# EAGLE design interceptor (EAGLE 8.5.1)
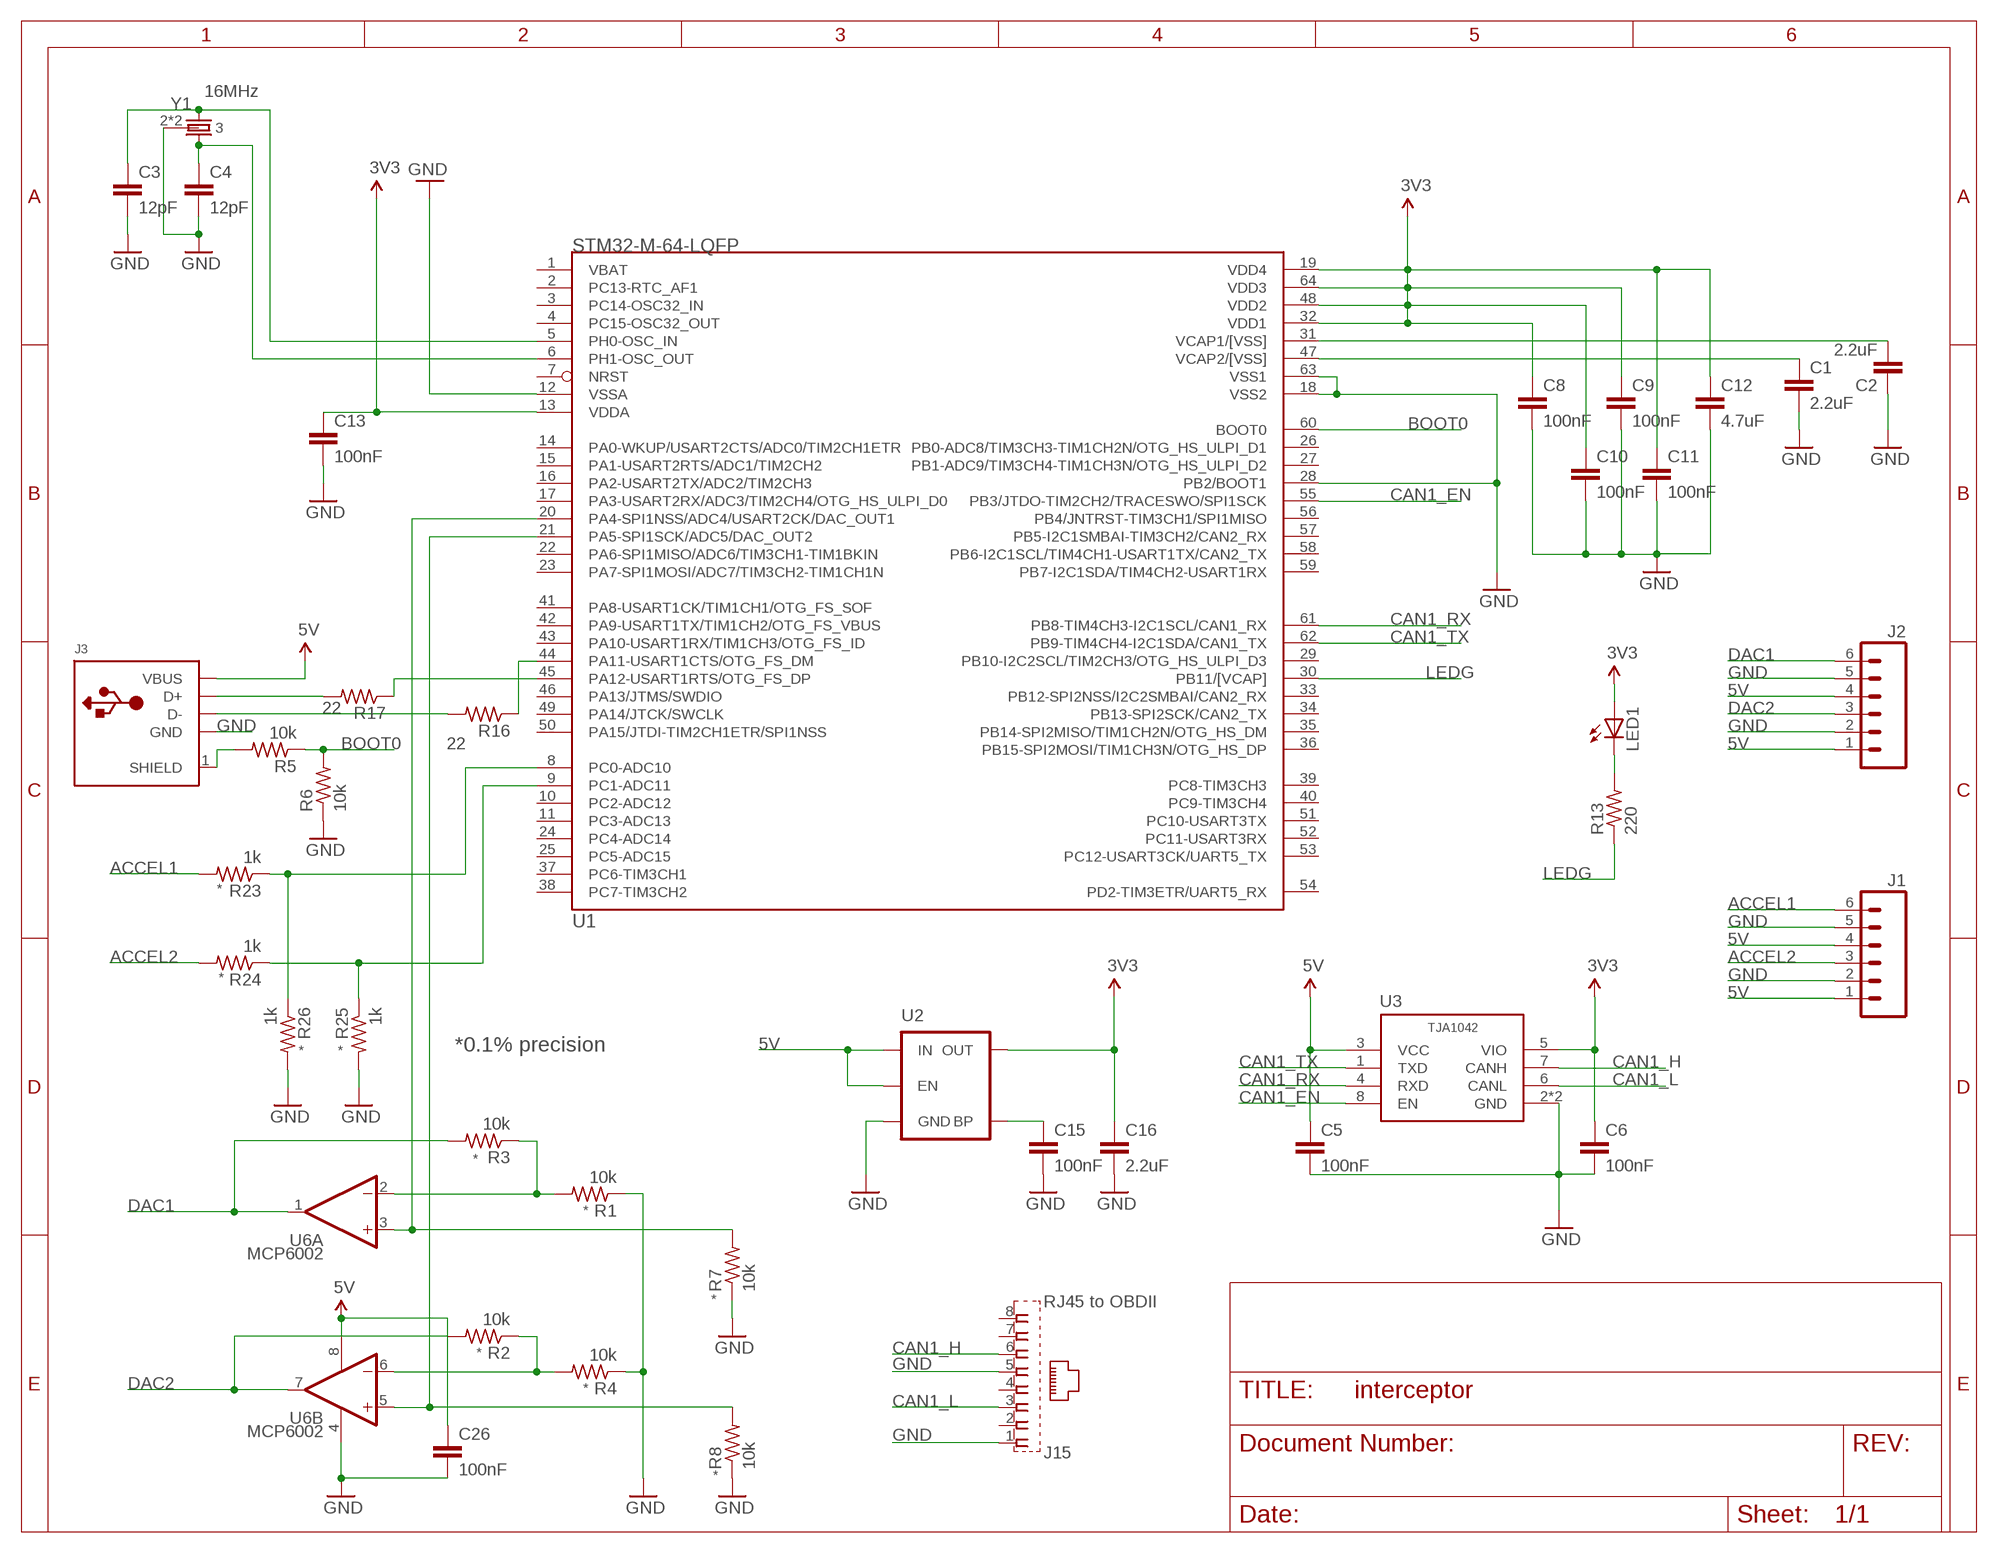
[diagram p0: schematic, sheet 1]

## Parts
C1  2.2uF  C0603  [0603-C]
C2  2.2uF  C0603  [0603-C]
C3  12pF  C0603  [0603-C]
C4  12pF  C0603  [0603-C]
C5  100nF  C0603  [0603-C]
C6  100nF  C0603  [0603-C]
C8  100nF  C0603  [0603-C]
C9  100nF  C0603  [0603-C]
C10  100nF  C0603  [0603-C]
C11  100nF  C0603  [0603-C]
C12  4.7uF  C0603  [0603-C]
C13  100nF  C0603  [0603-C]
C15  100nF  C0603  [0603-C]
C16  2.2uF  C0603  [0603-C]
C26  100nF  C0603  [0603-C]
J1  M06NO_SILK_YES_STOP  [1X06_NO_SILK_YES_STOP]
J2  M06NO_SILK_YES_STOP  [1X06_NO_SILK_YES_STOP]
J3  USB-ASMD-F  [USB-A-S]
J15  RJ45 to OBDII  RA-RJ45RA  [RA-RJ45]
LED1  LEDCHIPLED_0805  [CHIPLED_0805]
R1  10k  R0402  [0402-R]
R2  10k  R0402  [0402-R]
R3  10k  R0402  [0402-R]
R4  10k  R0402  [0402-R]
R5  10k  R0402  [0402-R]
R6  10k  R0402  [0402-R]
R7  10k  R0402  [0402-R]
R8  10k  R0402  [0402-R]
R13  220  R0402  [0402-R]
R16  22  R0402  [0402-R]
R17  22  R0402  [0402-R]
R23  1k  R0402  [0402-R]
R24  1k  R0402  [0402-R]
R25  1k  R0402  [0402-R]
R26  1k  R0402  [0402-R]
U1  STM32-M-64-LQFP  [LQFP64]
U2  MIC52053.3V  [SOT23-5]
U3  TJA1042HVSON  [HVSON8]
U6  MCP6002  LM358D  [SO08]
Y1  16MHz  CRYSTAL-3.2X2.54-PIN  [XTAL-3.2X2.5]

## Nets
3V3: C6.1 C8.1 C9.1 C10.1 C11.1 C12.1 C13.1 C16.1 LED1.A U1.13(VDDA) U1.19(VDD4) U1.32(VDD1) U1.48(VDD2) U1.64(VDD3) U2.5(OUT) U3.5(VIO)
5V: C5.1 C26.1 J1.1 J1.4 J2.1 J2.4 J3.VBUS U2.1(IN) U2.3(EN) U3.3(VCC) U6.8(P:V+)
ACCEL1: J1.6 R23.2
ACCEL2: J1.3 R24.2
BOOT0: R5.1 R6.2 U1.60(BOOT0)
CAN1_EN: U1.55(PB3/JTDO-TIM2CH2/TRACESWO/SPI1SCK) U3.8(EN)
CAN1_H: J15.6 U3.7(CANH)
CAN1_L: J15.3 U3.6(CANL)
CAN1_RX: U1.61(PB8-TIM4CH3-I2C1SCL/CAN1_RX) U3.4(RXD)
CAN1_TX: U1.62(PB9-TIM4CH4-I2C1SDA/CAN1_TX) U3.1(TXD)
DAC1: J2.6 R3.2 U6.1(A:OUT)
DAC2: J2.3 R2.2 U6.7(B:OUT)
GND: C1.2 C2.1 C3.2 C4.2 C5.2 C6.2 C8.2 C9.2 C10.2 C11.2 C12.2 C13.2 C15.2 C16.2 C26.2 J1.2 J1.5 J2.2 J2.5 J3.GND J15.1 J15.5 R1.1 R4.1 R6.1 R7.1 R8.1 R25.2 R26.2 U1.12(VSSA) U1.18(VSS2) U1.28(PB2/BOOT1) U1.63(VSS1) U2.2(GND) U3.2(GND) U3.PAD(GND) U6.4(P:V-) Y1.2 Y1.4
LEDG: R13.1 U1.30(PB11/[VCAP])
N$1: C3.1 U1.5(PH0-OSC_IN) Y1.1
N$2: R16.1 U1.44(PA11-USART1CTS/OTG_FS_DM)
N$3: C4.1 U1.6(PH1-OSC_OUT) Y1.3
N$4: R17.1 U1.45(PA12-USART1RTS/OTG_FS_DP)
N$5: J3.D- R16.2
N$6: J3.D+ R17.2
N$7: J3.1(SHIELD) R5.2
N$17: R7.2 U1.20(PA4-SPI1NSS/ADC4/USART2CK/DAC_OUT1) U6.3(A:+IN)
N$18: R8.2 U1.21(PA5-SPI1SCK/ADC5/DAC_OUT2) U6.5(B:+IN)
N$21: R1.2 R3.1 U6.2(A:-IN)
N$22: R2.1 R4.2 U6.6(B:-IN)
N$26: LED1.C R13.2
N$29: C15.1 U2.4(BP)
N$41: R23.1 R26.1 U1.8(PC0-ADC10)
N$42: R24.1 R25.1 U1.9(PC1-ADC11)
VCAP1: C2.2 U1.31(VCAP1/[VSS])
VCAP2: C1.1 U1.47(VCAP2/[VSS])
Unconnected: J15.2 J15.4 J15.7 J15.8 U1.1(VBAT) U1.2(PC13-RTC_AF1) U1.3(PC14-OSC32_IN) U1.4(PC15-OSC32_OUT) U1.7(NRST) U1.10(PC2-ADC12) U1.11(PC3-ADC13) U1.14(PA0-WKUP/USART2CTS/ADC0/TIM2CH1ETR) U1.15(PA1-USART2RTS/ADC1/TIM2CH2) U1.16(PA2-USART2TX/ADC2/TIM2CH3) U1.17(PA3-USART2RX/ADC3/TIM2CH4/OTG_HS_ULPI_D0) U1.22(PA6-SPI1MISO/ADC6/TIM3CH1-TIM1BKIN) U1.23(PA7-SPI1MOSI/ADC7/TIM3CH2-TIM1CH1N) U1.24(PC4-ADC14) U1.25(PC5-ADC15) U1.26(PB0-ADC8/TIM3CH3-TIM1CH2N/OTG_HS_ULPI_D1) U1.27(PB1-ADC9/TIM3CH4-TIM1CH3N/OTG_HS_ULPI_D2) U1.29(PB10-I2C2SCL/TIM2CH3/OTG_HS_ULPI_D3) U1.33(PB12-SPI2NSS/I2C2SMBAI/CAN2_RX) U1.34(PB13-SPI2SCK/CAN2_TX) U1.35(PB14-SPI2MISO/TIM1CH2N/OTG_HS_DM) U1.36(PB15-SPI2MOSI/TIM1CH3N/OTG_HS_DP) U1.37(PC6-TIM3CH1) U1.38(PC7-TIM3CH2) U1.39(PC8-TIM3CH3) U1.40(PC9-TIM3CH4) U1.41(PA8-USART1CK/TIM1CH1/OTG_FS_SOF) U1.42(PA9-USART1TX/TIM1CH2/OTG_FS_VBUS) U1.43(PA10-USART1RX/TIM1CH3/OTG_FS_ID) U1.46(PA13/JTMS/SWDIO) U1.49(PA14/JTCK/SWCLK) U1.50(PA15/JTDI-TIM2CH1ETR/SPI1NSS) U1.51(PC10-USART3TX) U1.52(PC11-USART3RX) U1.53(PC12-USART3CK/UART5_TX) U1.54(PD2-TIM3ETR/UART5_RX) U1.56(PB4/JNTRST-TIM3CH1/SPI1MISO) U1.57(PB5-I2C1SMBAI-TIM3CH2/CAN2_RX) U1.58(PB6-I2C1SCL/TIM4CH1-USART1TX/CAN2_TX) U1.59(PB7-I2C1SDA/TIM4CH2-USART1RX)

## Notes on the sheet
- *
- *
- * | * | *0.1% precision
- *
- *
- *
- *
- *
- *

## Library data of the parts
C1-C6 C8-C13 C15 C16 C26 = comma.ai:C
J1 J2 = SparkFun-Connectors:M06: Header 6 Standard 6-pin 0.1" header. Use with straight break away headers (SKU : PRT-00116), right angle break away headers (PRT-00553), swiss pins (PRT-00743), machine pins (PRT-00117), and female headers (PRT-00115). Molex polarized connector foot print use with SKU : PRT-08094 with associated crimp pins and housings. NOTES ON THE VARIANTS LOCK and LOCK_LONGPADS... This footprint was designed to help hold the alignment of a through-hole component (i.e. 6-pin header) while soldering it into place. You may notice that each hole has been shifted either up or down by 0.005 of an inch from it's more standard position (which is a perfectly straight line). This slight alteration caused the pins (the squares in the middle) to touch the edges of the holes. Because they are alternating, it causes a "brace" to hold the component in place. 0.005 has proven to be the perfect amount of "off-center" position when using our standard breakaway headers. Although looks a little odd when you look at the bare footprint, once you have a header in there, the alteration is very hard to notice. Also,if you push a header all the way into place, it is covered up entirely on the bottom side. This idea of altering the position of holes to aid alignment will be further integrated into the Sparkfun Library for other footprints. It can help hold any component with 3 or more connection pins.
J3 = comma.ai:USB-A
J15 = comma.ai:RA-RJ45
LED1 = adafruit:LED: LED OSRAM: - CHIPLED LG R971, LG N971, LY N971, LG Q971, LY Q971, LO R971, LY R971 LH N974, LH R974 LS Q976, LO Q976, LY Q976 LO Q996 - Hyper CHIPLED LW Q18S LB Q993, LB Q99A, LB R99A - SideLED LS A670, LO A670, LY A670, LG A670, LP A670 LB A673, LV A673, LT A673, LW A673 LH A674 LY A675 LS A676, LA A676, LO A676, LY A676, LW A676 LS A679, LY A679, LG A679 - Hyper Micro SIDELED® LS Y876, LA Y876, LO Y876, LY Y876 LT Y87S - SmartLED LW L88C, LW L88S LB L89C, LB L89S, LG L890 LS L89K, LO L89K, LY L89K LS L896, LA L896, LO L896, LY L896 - TOPLED LS T670, LO T670, LY T670, LG T670, LP T670 LSG T670, LSP T670, LSY T670, LOP T670, LYG T670 LG T671, LOG T671, LSG T671 LB T673, LV T673, LT T673, LW T673 LH T674 LS T676, LA T676, LO T676, LY T676, LB T676, LH T676, LSB T676, LW T676 LB T67C, LV T67C, LT T67C, LS T67K, LO T67K, LY T67K, LW E67C LS E67B, LA E67B, LO E67B, LY E67B, LB E67C, LV E67C, LT E67C LW T67C LS T679, LY T679, LG T679 LS T770, LO T770, LY T770, LG T770, LP T770 LB T773, LV T773, LT T773, LW T773 LH T774 LS E675, LA E675, LY E675, LS T675 LS T776, LA T776, LO T776, LY T776, LB T776 LHGB T686 LT T68C, LB T68C - Hyper Mini TOPLED® LB M676 - Mini TOPLED Santana® LG M470 LS M47K, LO M47K, LY M47K Source: http://www.osram.convergy.de/
R1-R8 R13 R16 R17 R23-R26 = comma.ai:R
U1 = comma.ai:STM32-M-64-LQFP: STM32F103 Medium Density 64pin LQFP
U2 = SparkFun-PowerIC:MIC5205: MIC5205 150mA vreg 3.3V - VREG-00822 5V - VREG-00823; PROD_ID: VREG-00822
U3 = comma.ai:TJA1042
U6 = comma.ai:LM358: OP AMP also LM158; LM258; LM2904 Source: http://cache.national.com/ds/LM/LM158.pdf
Y1 = comma.ai:CRYSTAL-3.2X2.5

## Board
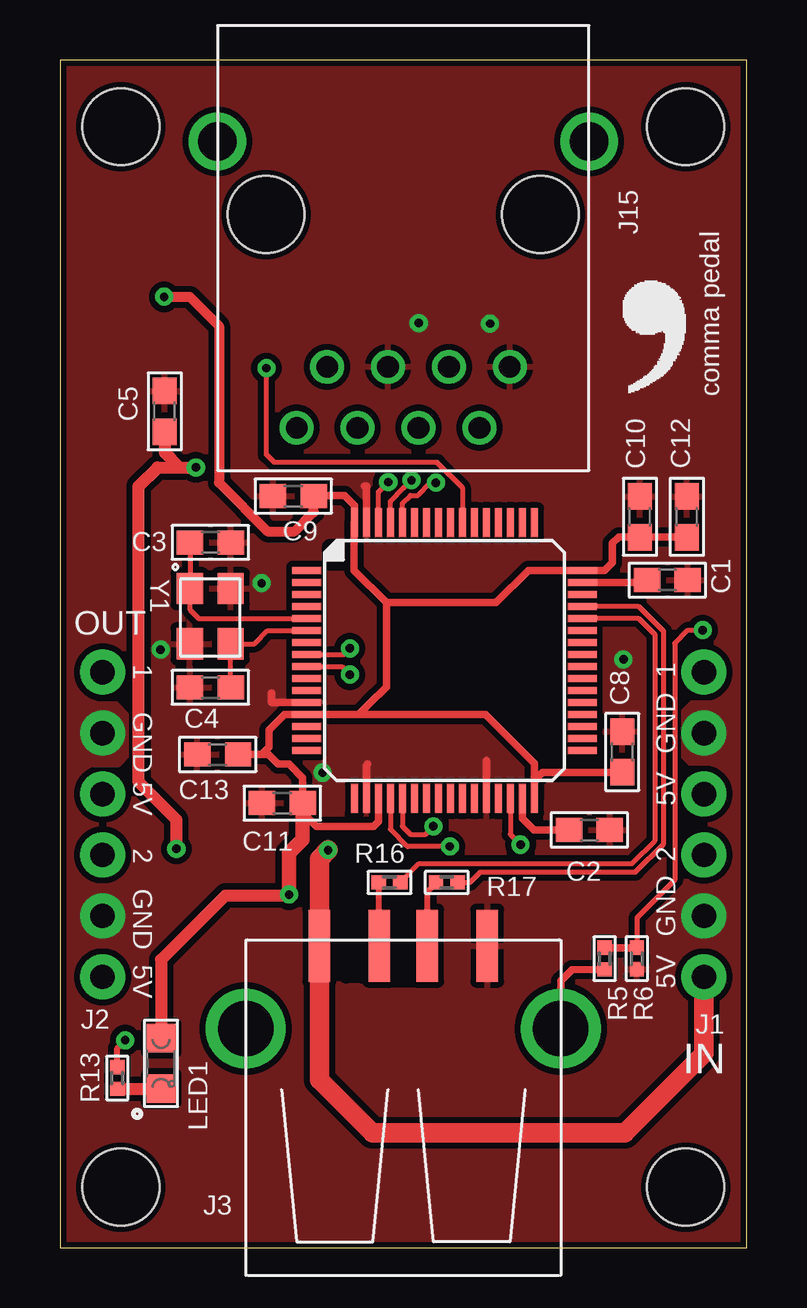
[diagram p1: board, top side]
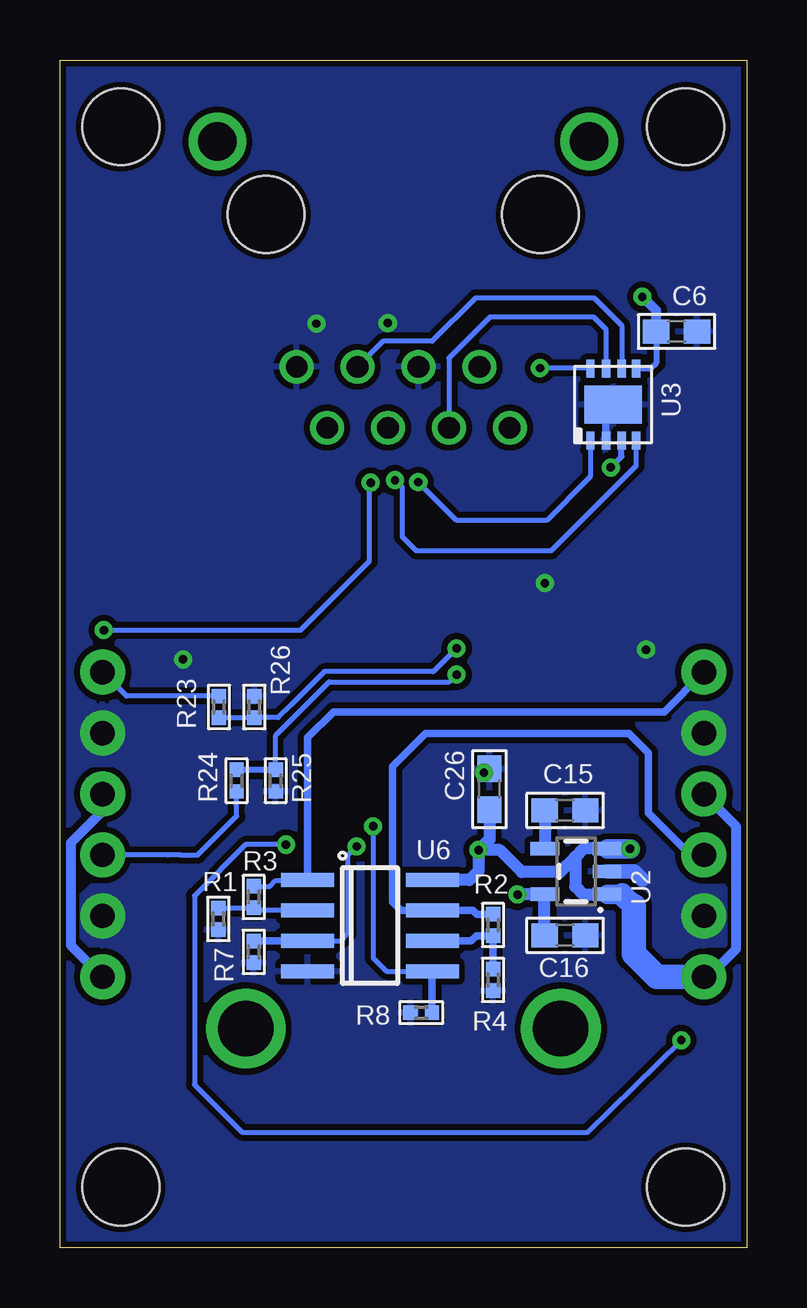
[diagram p2: board, bottom side, seen from below]

Size 28.63 x 49.52 mm. Coordinates in mm from the lower left corner, seen from the top.
Outline: 0,0 28.63,0 28.63,49.52 0,49.52 0,0
Copper layers (1*16): Top 0.035mm / dielectric 1.5mm / Bottom 0.035mm
Design rules "default *": minimum track width 6mil, minimum drill 10mil, track to track 6mil, track to pad 6mil, pad to pad 6mil, via to via 6mil, smd to smd 6mil, copper to edge 10mil, drill to drill 8mil, minimum pad ring 10mil, minimum via ring 8mil, stop-mask expansion 4mil, vias tented up to drill 0mil, thermal gap 10mil
Holes 3.2 mm at 2.54,46.74 26.09,46.74 26.09,2.54 2.54,2.54
tRestrict: area 11.9,11.4 to 14.4,17.1; area 14,11.2 to 14.6,14.1; area 11.3,28.6 to 11.9,29.2

### Footprints (pad centres in the part's own frame; a part is rotated, then mirrored left to right if it is on the bottom)
0603-C = smd 1.1 x 1: 1 -0.85,0; 2 0.85,0
1X06_NO_SILK_YES_STOP = drill 1.016 pad 1.88: 1 0,0; 2 2.54,0; 3 5.08,0; 4 7.62,0; 5 10.16,0; 6 12.7,0
USB-A-S = drill 2.311: 1 0,-6.566; 2 0,6.566 | smd 3 x 0.9: D+ 3.45,-1; D- 3.45,1; GND 3.45,-3.5; VBUS 3.45,3.5
RA-RJ45 = drill 0.9: 1 -4.445,6.35; 2 -3.175,8.89; 3 -1.905,6.35; 4 -0.635,8.89; 5 0.635,6.35; 6 1.905,8.89; 7 3.175,6.35; 8 4.445,8.89 | drill 1.6: P$1 -7.75,-3.05; P$2 7.75,-3.05 | hole 3.2: -5.715,0; 5.715,0
CHIPLED_0805 = smd 1.2 x 1.2: A 0,-1.05; C 0,1.05
0402-R = smd 0.6 x 0.6: 1 -0.45,0; 2 0.45,0
LQFP64 = smd 1.2 x 0.3: 1 -5.75,3.75; 2 -5.75,3.25; 3 -5.75,2.75; 4 -5.75,2.25; 5 -5.75,1.75; 6 -5.75,1.25; 7 -5.75,0.75; 8 -5.75,0.25; 9 -5.75,-0.25; 10 -5.75,-0.75; 11 -5.75,-1.25; 12 -5.75,-1.75; 13 -5.75,-2.25; 14 -5.75,-2.75; 15 -5.75,-3.25; 16 -5.75,-3.75; 33 5.75,-3.75; 34 5.75,-3.25; 35 5.75,-2.75; 36 5.75,-2.25; 37 5.75,-1.75; 38 5.75,-1.25; 39 5.75,-0.75; 40 5.75,-0.25; 41 5.75,0.25; 42 5.75,0.75; 43 5.75,1.25; 44 5.75,1.75; 45 5.75,2.25; 46 5.75,2.75; 47 5.75,3.25; 48 5.75,3.75 | smd 0.3 x 1.2: 17 -3.75,-5.75; 18 -3.25,-5.75; 19 -2.75,-5.75; 20 -2.25,-5.75; 21 -1.75,-5.75; 22 -1.25,-5.75; 23 -0.75,-5.75; 24 -0.25,-5.75; 25 0.25,-5.75; 26 0.75,-5.75; 27 1.25,-5.75; 28 1.75,-5.75; 29 2.25,-5.75; 30 2.75,-5.75; 31 3.25,-5.75; 32 3.75,-5.75; 49 3.75,5.75; 50 3.25,5.75; 51 2.75,5.75; 52 2.25,5.75; 53 1.75,5.75; 54 1.25,5.75; 55 0.75,5.75; 56 0.25,5.75; 57 -0.25,5.75; 58 -0.75,5.75; 59 -1.25,5.75; 60 -1.75,5.75; 61 -2.25,5.75; 62 -2.75,5.75; 63 -3.25,5.75; 64 -3.75,5.75
SOT23-5 = smd 0.55 x 1.2: 1 -0.95,-1.3; 2 0,-1.3; 3 0.95,-1.3; 4 0.95,1.3; 5 -0.95,1.3
HVSON8 = smd 0.75 x 0.35: 1 -1.5,0.95; 2 -1.5,0.3; 3 -1.5,-0.35; 4 -1.5,-0.95; 5 1.5,-0.95; 6 1.5,-0.35; 7 1.5,0.3; 8 1.5,0.95 | smd 1.6 x 2.4: PAD 0,0
SO08 = smd 0.6 x 2.2: 1 -1.905,-2.6; 2 -0.635,-2.6; 3 0.635,-2.6; 4 1.905,-2.6; 5 1.905,2.6; 6 0.635,2.6; 7 -0.635,2.6; 8 -1.905,2.6
XTAL-3.2X2.5 = smd 1.3 x 1.1: 1 0,-1.8; 2 2.3,-1.8; 3 2.3,-0.1; 4 0,-0.1

### Placement (x,y rotation side)
C1  25.32,27.84 0 top
C2  22.07,17.42 180 top
C3  6.27,29.41 0 top
C4  6.27,23.37 180 top
C5  4.37,34.87 90 top
C6  2.92,38.2 0 bottom
C8  23.44,20.68 90 top
C9  9.73,31.34 180 top
C10  24.18,30.48 90 top
C11  9.27,18.54 180 top
C12  26.14,30.48 90 top
C13  6.58,20.57 180 top
C15  7.57,18.24 0 bottom
C16  7.57,13.03 0 bottom
C26  10.72,19.13 90 bottom
J1  26.85,11.3 90 top
J2  1.78,11.3 90 top
J3  14.31,9.14 90 top
J15  14.31,43.08 180 top
LED1  4.22,7.7 180 top
R1  22.02,13.72 90 bottom
R2  10.57,13.46 90 bottom
R3  20.55,14.63 90 bottom
R4  10.57,11.18 90 bottom
R5  22.71,12.06 270 top
R6  24.05,12.06 90 top
R7  20.55,12.34 90 bottom
R8  13.56,9.8 0 bottom
R13  2.39,7.09 270 top
R16  13.74,15.24 180 top
R17  16.13,15.24 180 top
R23  22,22.56 90 bottom
R24  21.26,19.48 270 bottom
R25  19.63,19.48 270 bottom
R26  20.52,22.56 90 bottom
U1  16.03,24.49 0 top
U2  7.11,15.7 90 bottom
U3  5.56,35.15 90 bottom
U6  15.7,13.44 270 bottom
U$1  [LOGO]  22.81,35.33 0 top
Y1  7.21,27.48 270 top

### Tracks (layer width: path | path; a pad name or v marks a point on that pad's centre or on a via)
3V3  (via drill 0.35)
  Top 0.203: 24.17,29.64 C10.1
  Top 0.254: 12.89,22.67 12.45,22.23 | 21.76,28.22 U1.48
  Top 0.305: 24.17,29.64 23.29,29.64 23.04,29.39 23.04,28.57 22.7,28.24 U1.48 19.52,28.24 18.19,26.9 13.61,26.9 | C10.1 C12.1 | C8.1 23.56,19.81 20.12,19.81 19.78,19.47 U1.32 19.78,20.2 17.74,22.24 12.46,22.24 | 13.61,26.9 12.27,28.25 12.27,30.25 U1.64 12.28,30.95 11.86,31.37 10.6,31.37 C9.1 | 13.61,26.9 13.61,23.39 12.89,22.67 12.46,22.24 | U1.19 13.28,17.77 13.08,17.58 10.71,17.58 10.12,18.16 | C11.1 10.12,19.6 9.55,20.17 9.09,20.17 8.69,20.57 C13.1 8.41,20.57 8.71,20.88 8.71,21.59 9.36,22.24 U1.13 12.46,22.24
  Top 0.406: v4.34,39.65 5.41,39.65 6.63,38.43 6.63,31.9 8.66,29.87 9.78,29.87 10.58,30.67 C9.1 10.77,31.46
  Top 0.508: LED1.A 4.22,12.01 6.9,14.69 9.51,14.69 v9.55,14.73
  Top 0.61: v9.55,14.73 9.55,16.46 10.12,17.03 10.12,18.16 C11.1
  Bottom 0.254: C6.1 3.77,36.89 4.01,36.65 U3.5
  Bottom 0.406: C6.1 3.77,39.08 v4.34,39.65
  Bottom 0.508: C16.1 U2.5 | U2.5 | U2.5 v9.54,14.74 v9.55,14.73
5V  (via drill 0.35)
  Top 0.508: v4.85,16.64 4.85,17.86 3.28,19.43 3.28,31.75 4.06,32.54 4.98,32.54 | 4.98,32.54 v5.66,32.54 | C5.1 4.37,33.15 4.98,32.54
  Top 0.813: v11.18,16.59 10.81,16.22 J3.VBUS 10.81,7.02 13.03,4.8 23.55,4.8 26.85,8.1 J1.1
  Bottom 0.254: v5.66,32.54 5.21,32.99 U3.3
  Bottom 0.406: J1.4 26.85,18.21 28.17,16.89 28.17,12.62 J1.1 | J2.4 0.46,17.6 0.46,12.45 1.6,11.3 J2.1
  Bottom 0.508: 7.14,16.31 6.8,16.65 U2.3 5.8,16.64 | 7.14,16.31 7.14,15.06 6.82,14.75 U2.1 | 7.14,16.31 7.77,15.67 9.37,15.67 10.29,16.59 v11.18,16.59 | C26.1 10.72,17.04 v11.18,16.59 | v11.18,16.59 11.18,15.72 11.56,15.34 U6.8
  Bottom 0.813: 5.8,16.64 v4.85,16.64 | U2.1 5.2,14.75
  Bottom 0.914: 5.2,14.75 4.7,14.25
  Bottom 1.016: 4.7,14.25 4.7,12.27 3.73,11.3 J2.1
ACCEL1
  Bottom 0.203: R23.2 25.85,23 J1.6
ACCEL2
  Bottom 0.203: J1.3 24.13,16.38 23.6,16.38 22.89,16.38 21.26,18.01 R24.2
BOOT0  (via drill 0.35)
  Top 0.203: 14.27,30.25 U1.60 14.28,31.04 14.61,31.37 14.92,31.37 15.45,31.9 v15.67,31.9 | v26.8,25.76 26.19,25.76 25.63,25.2 25.63,15.34 24.05,13.77 R6.2
  Top 0.305: R5.1 R6.2
  Bottom 0.203: v26.8,25.76 18.59,25.76 15.72,28.63 15.72,31.85 v15.67,31.9
CAN1_EN  (via drill 0.35)
  Top 0.203: U1.55 16.78,31.69 15.73,32.74 8.94,32.74 8.61,33.07 v8.61,36.68
  Bottom 0.203: U3.8 6.54,36.68 v8.61,36.68
CAN1_H
  Bottom 0.203: U3.7 5.87,38.3 6.38,38.81 10.69,38.81 12.41,37.1 J15.6
CAN1_L
  Bottom 0.203: U3.6 5.21,38.46 6.35,39.6 11.3,39.6 13.11,37.8 15.15,37.8 J15.3
CAN1_RX  (via drill 0.35)
  Top 0.203: 13.78,30.48 U1.61 13.78,31.12 14.32,31.67 v14.66,32
  Bottom 0.203: U3.4 4.61,32.6 8.15,29.06 13.77,29.06 14.35,29.64 14.35,31.7 v14.66,32
CAN1_TX  (via drill 0.35)
  Top 0.203: U1.62 13.28,31.52 v13.69,31.93
  Bottom 0.203: U3.1 6.51,32.15 6.63,32.03 8.33,30.33 11.43,30.33 11.89,30.33 12.09,30.33 v13.69,31.93
DAC1
  Bottom 0.203: R3.2 19.87,15.08 19.63,15.32 18.32,15.32 U6.1
  Bottom 0.305: U6.1 18.3,21.28 17.22,22.35 3.43,22.35 J2.6
DAC2
  Bottom 0.305: R2.2 11.24,13.91 11.4,14.07 U6.7 14.4,14.07 14.76,14.43 14.76,20.07 13.39,21.44 4.9,21.44 4.09,20.62 4.09,18.14 2.34,16.38 J2.3
GND  (via drill 0.35)
  Top 0.305: 12.83,20.17 12.78,20.12 U1.18 | U1.28 17.78,20.32 | U1.12 8.81,22.74 8.81,23.14 | U1.63 12.78,31.75 12.7,31.75
  Bottom 0.305: U3.2 5.86,34.85 U3.PAD | C26.2 10.78,19.98 v10.95,19.81
  Bottom 0.61: U2.2 4.67,15.7 4.34,15.37
  other vias: 23.5,24.54 14.96,38.56 17.93,38.53 8.41,27.71 4.19,24.94
  pour Top (isolate 0.254, rank 2): 0.36,49.48 0.33,-0.08 28.65,0 28.65,49.61
  pour Bottom (isolate 0.254): 0.3,49.48 0.3,0.05 28.75,0.18 28.75,49.61
  pour Top (no thermals): 25.58,14.43 25.58,13.08 26.06,12.6 27.89,12.6 28.24,12.95 28.24,14.68 27.91,15.01 26.16,15.01
  pour Top (no thermals): 2.9,22.17 2.36,22.71 0.81,22.71 0.38,22.28 0.38,20.9 0.38,20.47 0.74,20.12 2.46,20.12 2.9,20.55
  pour Top (no thermals): 3.07,14.61 2.54,15.14 0.99,15.14 0.56,14.71 0.56,13.34 0.56,12.9 0.91,12.55 2.64,12.55 3.07,12.98
  pour Top (no thermals): 28.4,22.23 27.86,22.76 26.31,22.76 25.88,22.33 25.88,20.95 25.88,20.52 26.24,20.17 27.97,20.17 28.4,20.6
  pour Bottom (no thermals): 2.57,15.11 3.1,14.58 3.1,13.03 2.67,12.6 1.3,12.6 0.86,12.6 0.51,12.95 0.51,14.68 0.94,15.11
  pour Bottom (no thermals): 2.51,22.71 3.05,22.17 3.05,20.62 2.62,20.19 1.24,20.19 0.81,20.19 0.46,20.55 0.46,22.28 0.89,22.71
  pour Bottom (no thermals): 27.64,22.63 28.17,22.1 28.17,20.55 27.74,20.12 26.37,20.12 25.93,20.12 25.58,20.47 25.58,22.2 26.01,22.63
  pour Bottom (no thermals): 27.33,15.14 27.86,14.61 27.86,13.06 27.43,12.62 26.06,12.62 25.63,12.62 25.27,12.98 25.27,14.71 25.7,15.14
LEDG  (via drill 0.35)
  Top 0.203: U1.30 18.78,17.24 v19.2,16.82
  Top 0.254: R13.1 2.39,8.33 v2.72,8.66
  Bottom 0.203: v19.2,16.82 20.88,16.82 23.01,14.68 23.01,6.81 21.03,4.83 6.63,4.83 v2.72,8.66
N$1
  Top 0.203: C3.1 5.42,27.49 Y1.1 5.41,26.62 5.79,26.24 U1.5
N$2
  Top 0.203: R16.1 14.98,16.03 23.85,16.03 24.82,16.99 24.82,25.55 24.13,26.24 U1.44
  Top 0.254: U1.44
N$3
  Top 0.203: U1.6 8.66,25.73 8.11,25.18 Y1.3 7.12,25.17 C4.1
N$4
  Top 0.203: R17.1 17.09,15.24 17.53,15.67 24,15.67 25.17,16.84 25.17,25.7 24.14,26.74 U1.45
N$5
  Top 0.254: R16.2 13.29,12.62 J3.D-
N$6
  Top 0.254: J3.D+ 15.31,14.87 R17.2
N$7
  Top 0.305: R5.2 21.34,11.59 20.88,11.12 J3.1
N$17  (via drill 0.35)
  Top 0.203: 13.79,18.72 U1.20 13.78,17.46 14.5,16.74 v16.26,16.74
  Bottom 0.203: U6.3 16.92,12.8 16.61,13.11 16.61,16.38 v16.26,16.74
  Bottom 0.305: U6.3 20.54,12.8 R7.2
N$18  (via drill 0.35)
  Top 0.203: U1.21 14.28,17.57 14.61,17.25 15.24,17.25 v15.57,17.58
  Bottom 0.203: v15.57,17.58 15.57,12.09 15.01,11.53 U6.5
  Bottom 0.305: R8.2 13.11,11.52 U6.5
N$21
  Bottom 0.203: U6.2 20.44,14.07 R3.1 20.56,14.17 R1.2
N$22
  Bottom 0.305: U6.6 11.48,12.8 11.27,13.01 R2.1 R4.2
N$26
  Top 0.508: R13.2 4.21,6.64 LED1.C
N$29
  Bottom 0.508: C15.1 U2.4
N$41  (via drill 0.35)
  Top 0.203: U1.8 11.83,24.74 v12.09,24.99
  Bottom 0.203: R23.1 R26.1 19.52,22.11 19,22.63 18.91,22.72 17.6,24.03 13.06,24.03 v12.09,24.99
N$42  (via drill 0.35)
  Top 0.203: U1.9 11.76,24.24 v12.09,23.9
  Bottom 0.203: v12.09,23.9 12.39,23.6 17.4,23.6 19.63,21.36 R25.1
  Bottom 0.254: R25.1 R24.1
VCAP1
  Top 0.305: U1.31 19.28,17.91 19.76,17.42 C2.2
VCAP2
  Top 0.203: U1.47
  Top 0.305: U1.47 24.37,27.74 C1.1

### Text on the board
tPlace: comma pedal
tNames: OUT | 1 | 1 | GND | GND | 5V | 5V | 2 | 2 | GND | GND | 5V | 5V | IN